# Altium project PCB_Project.PrjPcb
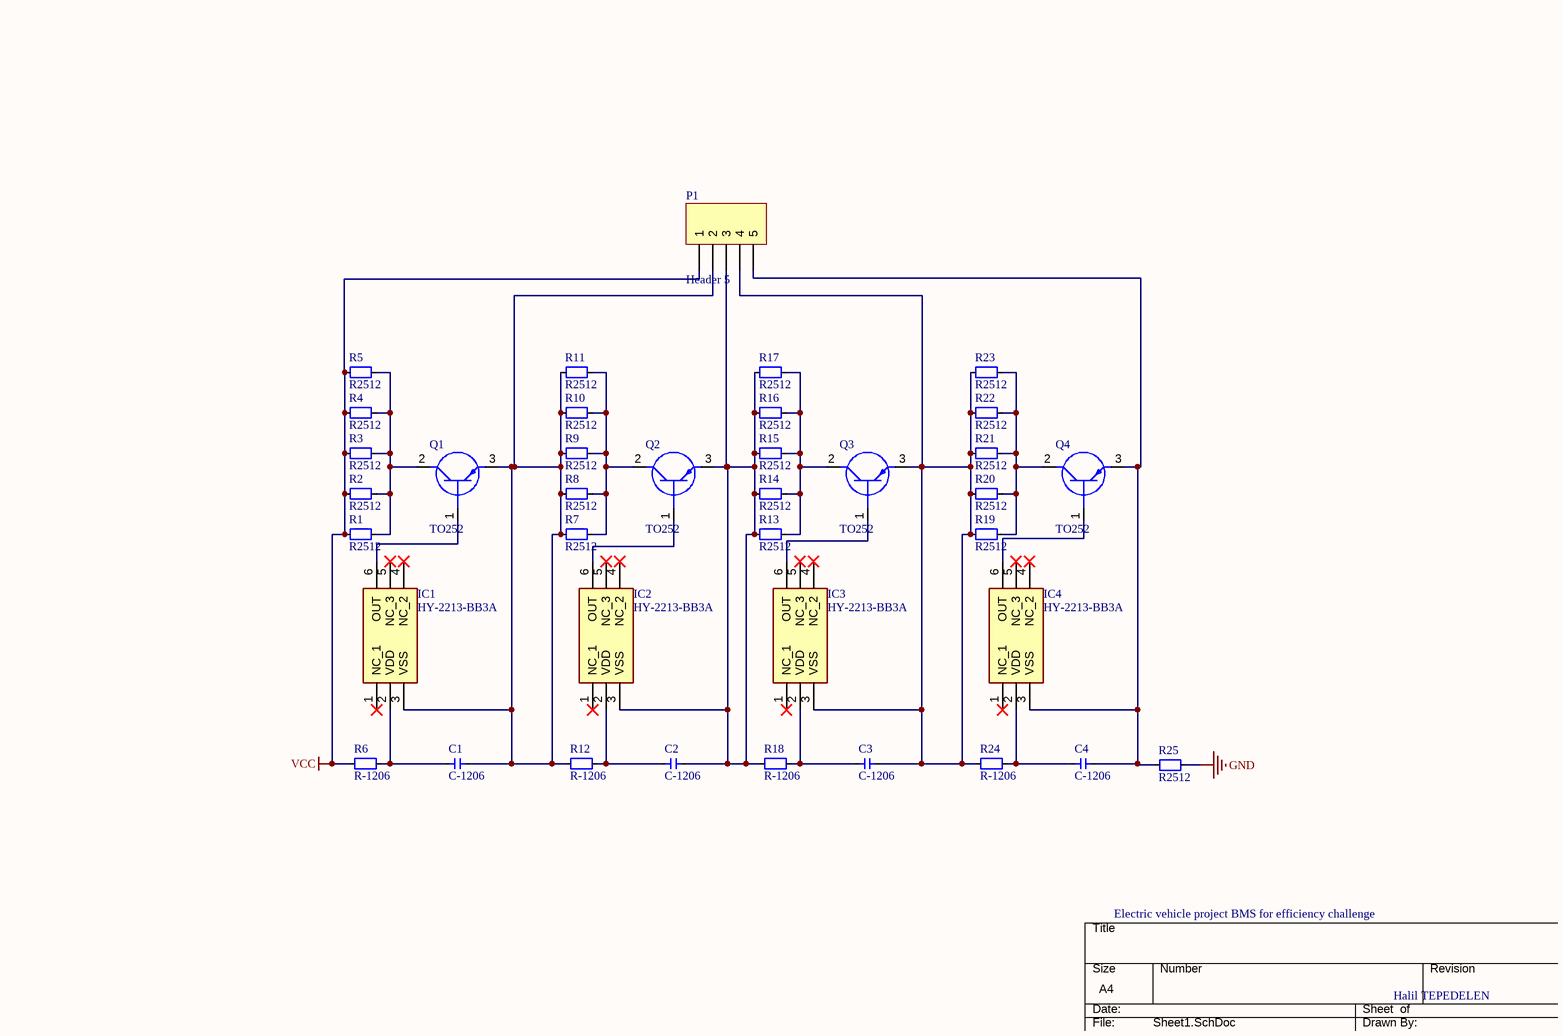
[diagram p0: Sheet1.SchDoc]
1 sheet, 38 parts. Net scope: global (net labels, ports and power ports of the same name join across sheets).
Board file: PCB1.PcbDoc

## Sheet Sheet1.SchDoc
size A4; SheetNumber: 1; SheetTotal: 1

### Parts
C1  C-1206  [C1206]
C2  C-1206  [C1206]
C3  C-1206  [C1206]
C4  C-1206  [C1206]
IC1  HY-2213-BB3A  [HY223]
IC2  HY-2213-BB3A  [HY223]
IC3  HY-2213-BB3A  [HY223]
IC4  HY-2213-BB3A  [HY223]
P1  Header 5  [HDR1X5]
Q1  TO252  [TO252]
Q2  TO252  [TO252]
Q3  TO252  [TO252]
Q4  TO252  [TO252]
R1  R2512  [R2512]
R2  R2512  [R2512]
R3  R2512  [R2512]
R4  R2512  [R2512]
R5  R2512  [R2512]
R6  R-1206  [R1206]
R7  R2512  [R2512]
R8  R2512  [R2512]
R9  R2512  [R2512]
R10  R2512  [R2512]
R11  R2512  [R2512]
R12  R-1206  [R1206]
R13  R2512  [R2512]
R14  R2512  [R2512]
R15  R2512  [R2512]
R16  R2512  [R2512]
R17  R2512  [R2512]
R18  R-1206  [R1206]
R19  R2512  [R2512]
R20  R2512  [R2512]
R21  R2512  [R2512]
R22  R2512  [R2512]
R23  R2512  [R2512]
R24  R-1206  [R1206]
R25  R2512  [R2512]

### Nets
GND: R25.1
VCC: P1.1 R1.2 R2.2 R3.2 R4.2 R5.2 R6.2
NetC1_1: C1.1 IC1.3(VSS) P1.2 Q1.3(E) R7.2 R8.2 R9.2 R10.2 R11.2 R12.2
NetC1_2: C1.2 IC1.2(VDD) R6.1
NetC2_1: C2.1 IC2.3(VSS) P1.3 Q2.3(E) R13.2 R14.2 R15.2 R16.2 R17.2 R18.2
NetC2_2: C2.2 IC2.2(VDD) R12.1
NetC3_1: C3.1 IC3.3(VSS) P1.4 Q3.3(E) R19.2 R20.2 R21.2 R22.2 R23.2 R24.2
NetC3_2: C3.2 IC3.2(VDD) R18.1
NetC4_1: C4.1 IC4.3(VSS) P1.5 Q4.3(E) R25.2
NetC4_2: C4.2 IC4.2(VDD) R24.1
NetIC1_6: IC1.6(OUT) Q1.1(B)
NetIC2_6: IC2.6(OUT) Q2.1(B)
NetIC3_6: IC3.6(OUT) Q3.1(B)
NetIC4_6: IC4.6(OUT) Q4.1(B)
NetQ1_2: Q1.2(C) R1.1 R2.1 R3.1 R4.1 R5.1
NetQ2_2: Q2.2(C) R7.1 R8.1 R9.1 R10.1 R11.1
NetQ3_2: Q3.2(C) R13.1 R14.1 R15.1 R16.1 R17.1
NetQ4_2: Q4.2(C) R19.1 R20.1 R21.1 R22.1 R23.1

Not connected (* = marked no-connect by the designer): IC1 1(NC_1)* 4(NC_2)* 5(NC_3)*; IC2 1(NC_1)* 4(NC_2)* 5(NC_3)*; IC3 1(NC_1)* 4(NC_2)* 5(NC_3)*; IC4 1(NC_1)* 4(NC_2)* 5(NC_3)*

### Notes on the sheet
- Electric vehicle project BMS for efficiency challenge
- Halil TEPEDELEN
- DWG NO:
- REV:
- THIS DOCUMENT AND THE DATA DISCLOSED HEREIN OR
- HEREWITH IS THE PROPERTY OF ALTIUM LIMITED AND MAY
- BE FREELY DISTRIBUTED IN WHOLE. NO RIGHTS ARE
- RESERVED OR EXPRESS OR IMPLIED WARANTEE GIVEN.
- REVISION
- DESCRIPTION
- DATE
- APPROVED
- ENG:
- APPROVALS
- PROJECT
- DSN:
- CHK:
- REFERENCE DOCUMENTS
- PROJECT REVISION:
- TITLE
- DOCUMENT REVISION:
- DESIGN ITEM:
- BOM:
- FAB DWG:
- PCB DWG:
- ASSY DWG:
- SCALE:
- A2
- SIZE
- CAGE CODE
- FILE NAME
- DWG NO.
- SHEET
- OF
- REV

### Library data of the parts
P1 = Header 5: Header, 5-Pin; LatestRevisionDate: 17-Jul-2002; LatestRevisionNote: Re-released for DXP Platform.; Publisher: Altium Limited